# EAGLE design AMR3350_old (EAGLE 9.2.0)
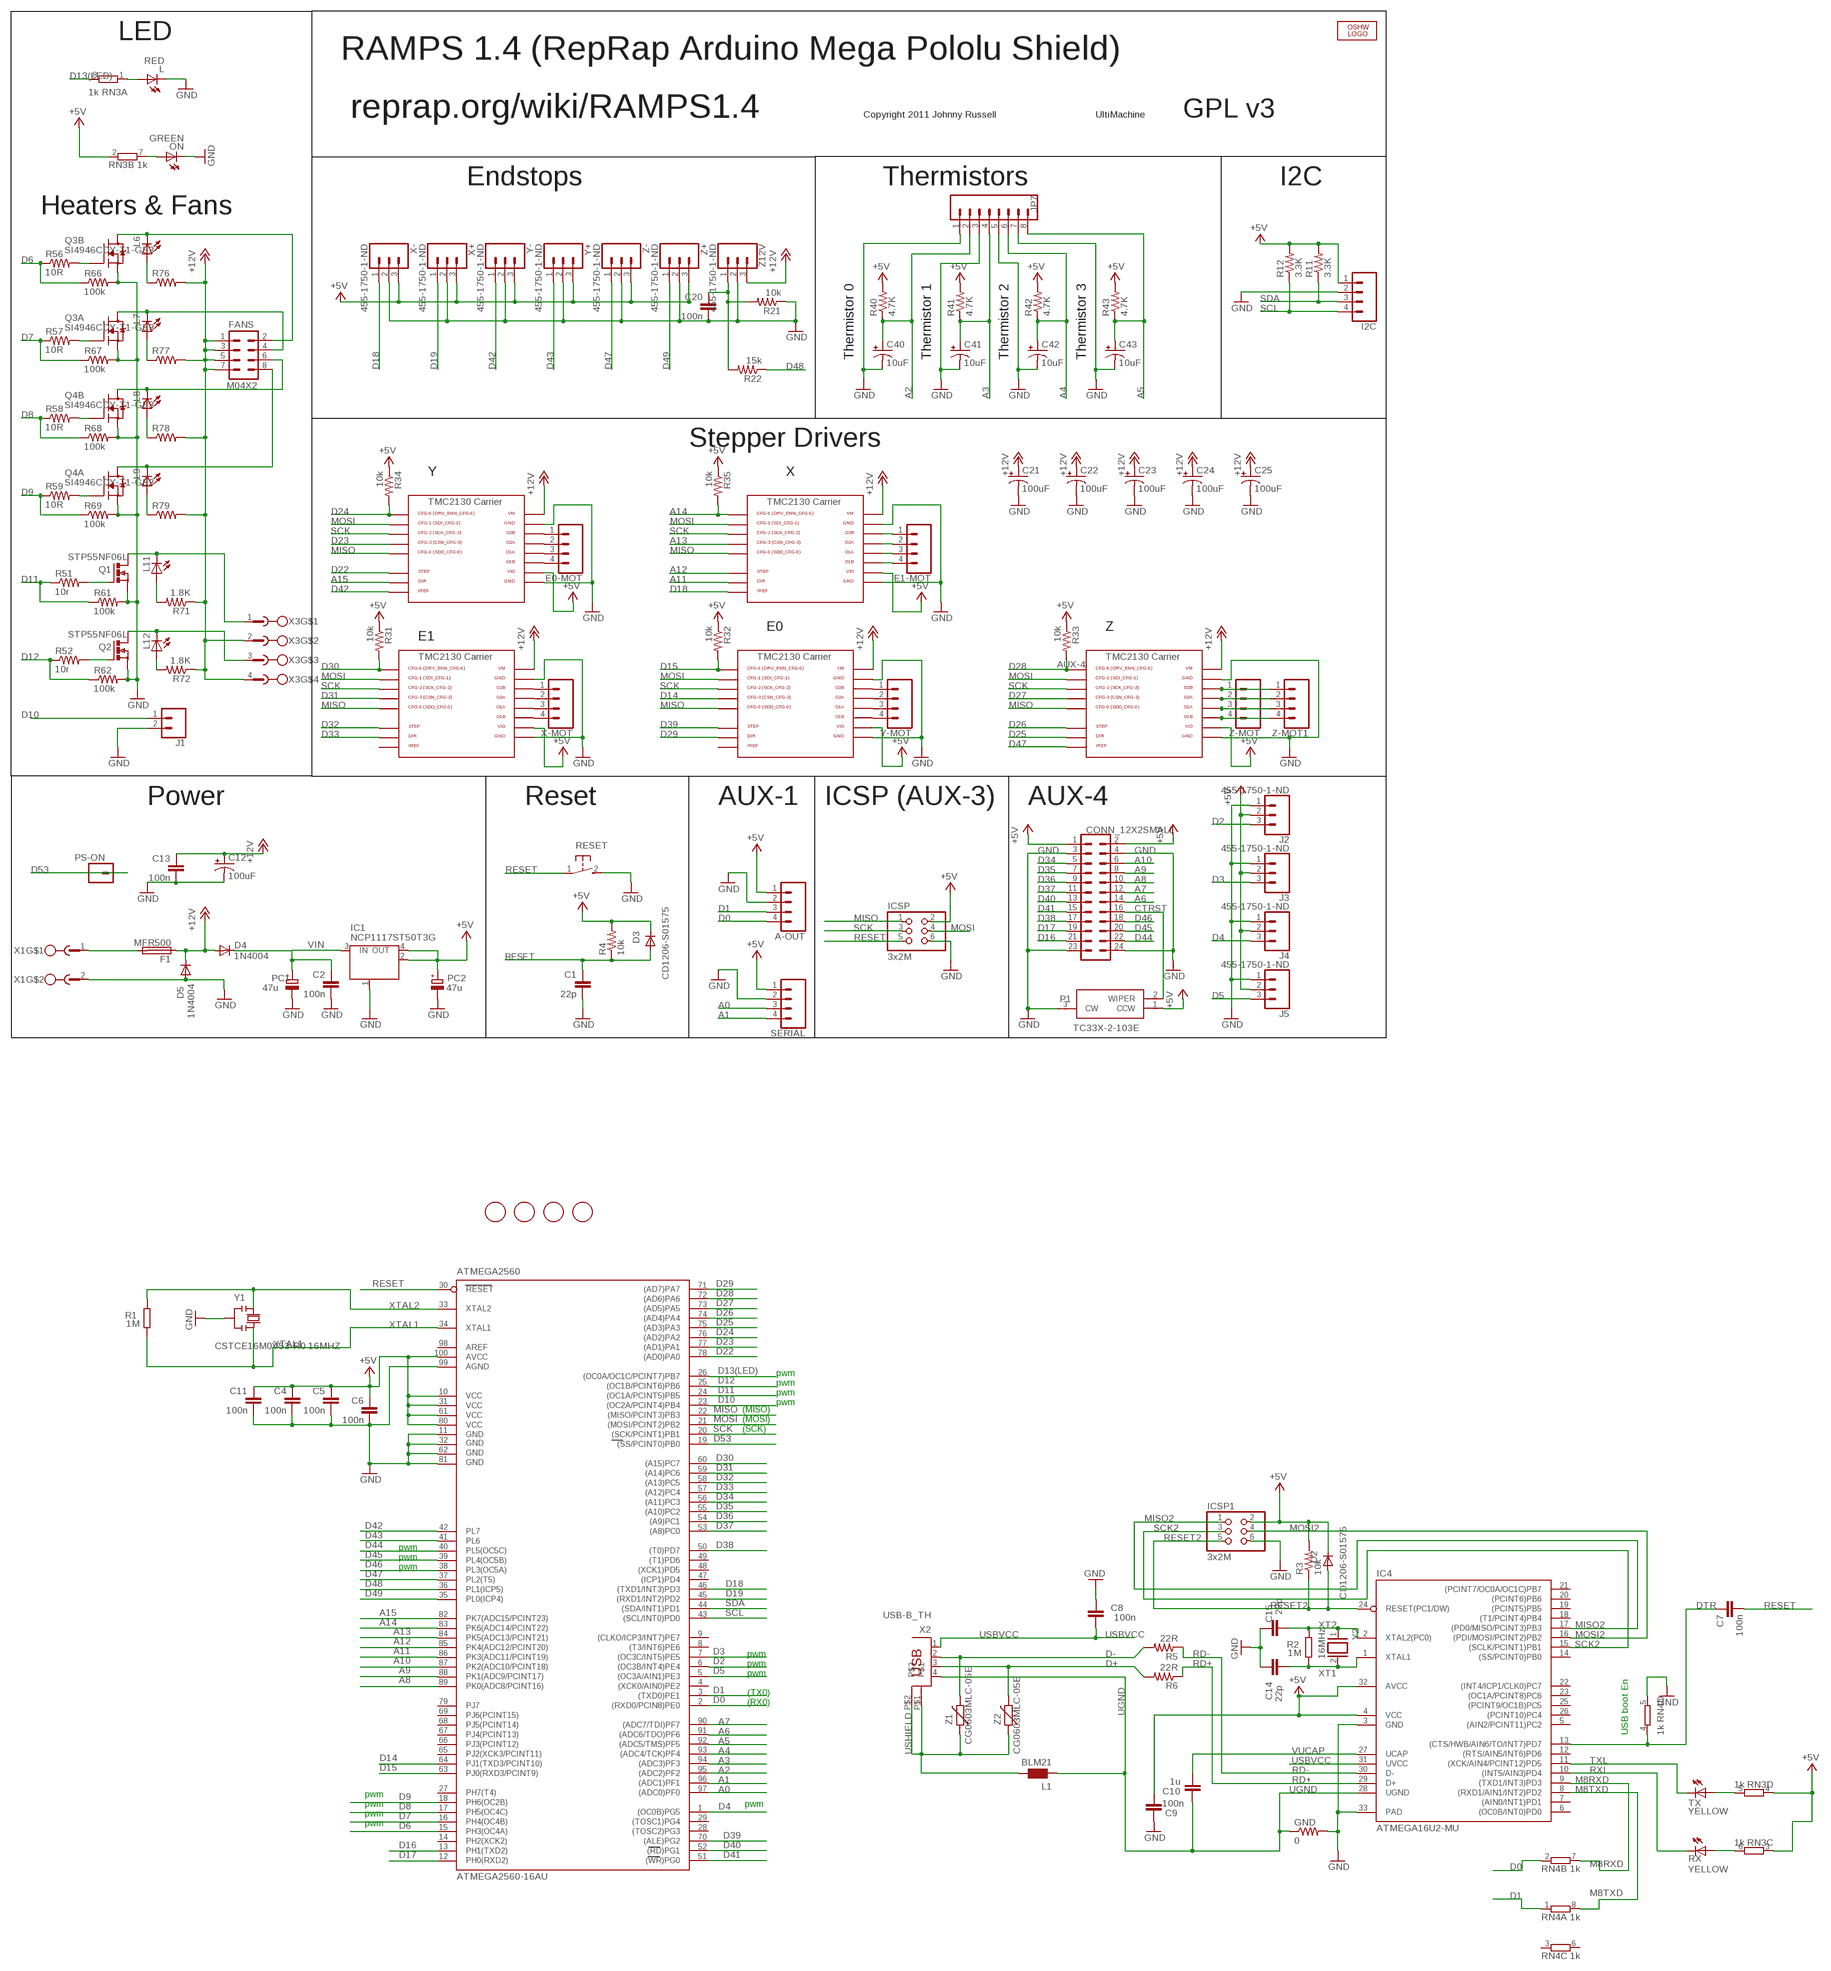
[diagram p0: schematic, sheet 1]

## Parts
A-OUT  CONN_04SMALL  [1X04_SMALL]
ATMEGA2560  ATMEGA2560-16AU  ATMEGA25602560-16AU  [TQFP100]
AUX-4  CONN_12X2SMALL  [2X12_SMALL]
C1  22p  C-EU  [C0805RND]
C2  100n  C-EU  [C0805RND]
C4  100n  C-EU  [C0805RND]
C5  100n  C-EU  [C0805RND]
C6  100n  C-EU  [C0805RND]
C7  100n  C-EU  [C0805RND]
C8  100n  C-EU0603-RND  [C0603-ROUND]
C9  100n  C-EU0603-RND  [C0603-ROUND]
C10  1u  C-EU0603-RND  [C0603-ROUND]
C11  100n  C-EU0603-RND  [C0603-ROUND]
C12  100uF  CPOL-US153CLV-0605  [153CLV-0605]
C13  100n  C-EU  [C0805RND]
C14  22p  C-EU0603-RND  [C0603-ROUND]
C15  22p  C-EU0603-RND  [C0603-ROUND]
C20  100n  C-EU  [C0805RND]
C21  100uF  CPOL-US153CLV-0605  [153CLV-0605]
C22  100uF  CPOL-US153CLV-0605  [153CLV-0605]
C23  100uF  CPOL-US153CLV-0605  [153CLV-0605]
C24  100uF  CPOL-US153CLV-0605  [153CLV-0605]
C25  100uF  CPOL-US153CLV-0605  [153CLV-0605]
C40  10uF  CPOL-US153CLV-0405  [153CLV-0405]
C41  10uF  CPOL-US153CLV-0405  [153CLV-0405]
C42  10uF  CPOL-US153CLV-0405  [153CLV-0405]
C43  10uF  CPOL-US153CLV-0405  [153CLV-0405]
D2  CD1206-S01575  DIODE-MINIMELF  [MINIMELF]
D3  CD1206-S01575  DIODE-MINIMELF  [MINIMELF]
D4  1N4004  [DO41-10]
D5  1N4004  [DO41-10]
E0-MOT  CONN_04SMALL  [1X04_SMALL]
E1-MOT  CONN_04SMALL  [1X04_SMALL]
F1  MFR500  PTCFUSE  [MFR500]
FANS  M04X2  [2X4]
FD1  FIDUCIALMOUNT  [FIDUCIA-MOUNT]
FD2  FIDUCIALMOUNT  [FIDUCIA-MOUNT]
FD3  FIDUCIALMOUNT  [FIDUCIA-MOUNT]
FD4  FIDUCIALMOUNT  [FIDUCIA-MOUNT]
GND  0  R-US_R0201  [R0201]
I2C  CONN_04SMALL  [1X04_SMALL]
IC1  NCP1117ST50T3G  MC33269ST-3.3T3  [SOT223]
IC4  ATMEGA16U2-MU  [MLF32]
ICSP  3x2M  PINHD-2X3  [2X03]
ICSP1  3x2M  PINHD-2X3  [2X03]
J1  CONN_02  [1X02]
J2  455-1750-1-ND  CONN_03SMALL  [1X03_SMALL]
J3  455-1750-1-ND  CONN_03SMALL  [1X03_SMALL]
J4  455-1750-1-ND  CONN_03SMALL  [1X03_SMALL]
J5  455-1750-1-ND  CONN_03SMALL  [1X03_SMALL]
JP7  CONN_08  [1X08_SMALL]
L  RED  LEDCHIP-LED0805  [CHIP-LED0805]
L1  BLM21  WE-CBF_0805  [0805]
L6  LEDCHIP-LED0603  [CHIP-LED0603]
L7  LEDCHIP-LED0603  [CHIP-LED0603]
L8  LEDCHIP-LED0603  [CHIP-LED0603]
L9  LEDCHIP-LED0603  [CHIP-LED0603]
L11  LEDCHIP-LED0805  [CHIP-LED0805]
L12  LEDCHIP-LED0805  [CHIP-LED0805]
LOGO2  OSHW_LOGO_6MILX0100-NT  [OSHW_6X100_NOTEXT]
ON  GREEN  LEDCHIP-LED0805  [CHIP-LED0805]
P1  TC33X-2-103E  [TC33X-2_1]
PC1  47u  CPOL-EUD  [PANASONIC_D]
PC2  47u  CPOL-EUD  [PANASONIC_D]
PS-ON  CONN_01SMALL  [1X01_SMALL]
Q1  STP55NF06L  IRF512  [TO220BV]
Q2  STP55NF06L  IRF512  [TO220BV]
Q3  SI4946CDY-T1-GE3  [SOIC127P600X175-8N]
Q4  SI4946CDY-T1-GE3  [SOIC127P600X175-8N]
R1  1M  R-EU_  [R0805RND]
R2  1M  R-EU_R0603  [R0603-ROUND]
R3  10k  R-US_R0805  [R0805]
R4  10k  R-US_R0805  [R0805]
R5  22R  R-US_R0603  [R0603]
R6  22R  R-US_R0603  [R0603]
R11  3.3K  R-US_R0805  [R0805]
R12  3.3K  R-US_R0805  [R0805]
R21  10k  R-US_R0805  [R0805]
R22  15k  R-US_R0805  [R0805]
R31  10k  R-US_R0805  [R0805]
R32  10k  R-US_R0805  [R0805]
R33  10k  R-US_R0805  [R0805]
R34  10k  R-US_R0805  [R0805]
R35  10k  R-US_R0805  [R0805]
R40  4.7K  R-US_R0805  [R0805]
R41  4.7K  R-US_R0805  [R0805]
R42  4.7K  R-US_R0805  [R0805]
R43  4.7K  R-US_R0805  [R0805]
R51  10r  R-US_R0805  [R0805]
R52  10r  R-US_M0805  [M0805]
R56  10R  R-US_R0805  [R0805]
R57  10R  R-US_R0805  [R0805]
R58  10R  R-US_R0805  [R0805]
R59  10R  R-US_R0805  [R0805]
R61  100k  R-US_R0805  [R0805]
R62  100k  R-US_R0805  [R0805]
R66  100k  R-US_R0805  [R0805]
R67  100k  R-US_R0805  [R0805]
R68  100k  R-US_R0805  [R0805]
R69  100k  R-US_R0805  [R0805]
R71  1.8K  R-US_R0805  [R0805]
R72  1.8K  R-US_R0805  [R0805]
R76  R-US_R0603  [R0603]
R77  R-US_R0603  [R0603]
R78  R-US_R0603  [R0603]
R79  R-US_R0603  [R0603]
RESET  31-XX  [B3F-31XX]
RN3  1k  4R-NCAY16  [CAY16]
RN4  1k  4R-NCAY16  [CAY16]
RX  YELLOW  LEDCHIP-LED0805  [CHIP-LED0805]
SERIAL  CONN_04SMALL  [1X04_SMALL]
TX  YELLOW  LEDCHIP-LED0805  [CHIP-LED0805]
U$1  TMC2130BREAKOUT  [TMC2130BREAKOUT]
U$2  TMC2130BREAKOUT  [TMC2130BREAKOUT]
U$3  TMC2130BREAKOUT  [TMC2130BREAKOUT]
U$4  TMC2130BREAKOUT  [TMC2130BREAKOUT]
U$5  TMC2130BREAKOUT  [TMC2130BREAKOUT]
X1  2-PIN  [2-PIN]
X2  USB-B_TH  PN61729NOSILK  [PN61729-NOSILK]
X3  4-PIN  [4-PIN]
X+  455-1750-1-ND  CONN_03SMALL  [1X03_SMALL]
X-  455-1750-1-ND  CONN_03SMALL  [1X03_SMALL]
X-MOT  CONN_04SMALL  [1X04_SMALL]
Y1  CSTCE16M0V53-R0 16MHZ  RESONATORMU  [RESONATOR]
Y2  16MHz  XTAL/S  [QS]
Y+  455-1750-1-ND  CONN_03SMALL  [1X03_SMALL]
Y-  455-1750-1-ND  CONN_03SMALL  [1X03_SMALL]
Y-MOT  CONN_04SMALL  [1X04_SMALL]
Z1  CG0603MLC-05E  VARISTORCN0603  [CT/CN0603]
Z2  CG0603MLC-05E  VARISTORCN0603  [CT/CN0603]
Z12V  455-1750-1-ND  CONN_03SMALL  [1X03_SMALL]
Z+  455-1750-1-ND  CONN_03SMALL  [1X03_SMALL]
Z-  455-1750-1-ND  CONN_03SMALL  [1X03_SMALL]
Z-MOT  CONN_04SMALL  [1X04_SMALL]
Z-MOT1  CONN_04SMALL  [1X04_SMALL]

## Nets
12V-IN [power]: F1.2 X1.1
+5V [power usb]: A-OUT.1 ATMEGA2560.10(VCC) ATMEGA2560.31(VCC1) ATMEGA2560.61(VCC2) ATMEGA2560.80(VCC3) ATMEGA2560.100(AVCC) AUX-4.1 AUX-4.2 C4.1 C5.1 C6.1 C9.1 C11.1 D2.C D3.C I2C.1 IC1.2(OUT) IC1.4(OUT) IC4.4(VCC) IC4.32(AVCC) ICSP1.2 ICSP.2 J2.2 J3.2 J4.2 J5.2 P1.1(CCW) PC2.+ R3.2 R4.2 R11.2 R12.2 R31.1 R32.1 R33.1 R34.1 R35.1 R40.2 R41.2 R42.2 R43.2 RN3.2 RN3.3 RN3.4 SERIAL.1 U$1.VIO U$2.VIO U$3.VIO U$4.VIO U$5.VIO X+.3 X-.3 Y+.3 Y-.3 Z+.3 Z-.3
+12V: C12.+ C13.1 C21.+ C22.+ C23.+ C24.+ C25.+ D4.A D5.C F1.1 FANS.1 FANS.3 FANS.5 FANS.7 R71.1 R72.1 R76.2 R77.2 R78.2 R79.2 U$1.VM U$2.VM U$3.VM U$4.VM U$5.VM X3.2 X3.4 Z12V.3
A0: ATMEGA2560.97((ADC0)PF0) SERIAL.3
A1: ATMEGA2560.96((ADC1)PF1) SERIAL.4
A2: ATMEGA2560.95((ADC2)PF2) C40.+ JP7.2 R40.1
A3: ATMEGA2560.94((ADC3)PF3) C41.+ JP7.4 R41.1
A4: ATMEGA2560.93((ADC4/TCK)PF4) C42.+ JP7.6 R42.1
A5: ATMEGA2560.92((ADC5/TMS)PF5) C43.+ JP7.8 R43.1
A6: ATMEGA2560.91((ADC6/TDO)PF6) AUX-4.14
A7: ATMEGA2560.90((ADC7/TDI)PF7) AUX-4.12
A8: ATMEGA2560.89(PK0(ADC8/PCINT16)) AUX-4.10
A9: ATMEGA2560.88(PK1(ADC9/PCINT17)) AUX-4.8
A10: ATMEGA2560.87(PK2(ADC10/PCINT18)) AUX-4.6
A11: ATMEGA2560.86(PK3(ADC11/PCINT19)) U$4.DIR
A12: ATMEGA2560.85(PK4(ADC12/PCINT20)) U$4.STEP
A13: ATMEGA2560.84(PK5(ADC13/PCINT21)) U$4.CFG-3
A14: ATMEGA2560.83(PK6(ADC14/PCINT22)) R35.2 U$4.CFG-6
A15: ATMEGA2560.82(PK7(ADC15/PCINT23)) U$5.DIR
CTRST: AUX-4.16 P1.2(WIPER)
D0: A-OUT.4 ATMEGA2560.2((RXD0/PCIN8)PE0) RN4.2
D1: A-OUT.3 ATMEGA2560.3((TXD0)PE1) RN4.1
D2: ATMEGA2560.6((OC3B/INT4)PE4) J2.3
D3: ATMEGA2560.7((OC3C/INT5)PE5) J3.3
D4: ATMEGA2560.1((OC0B)PG5) J4.3
D5: ATMEGA2560.5((OC3A/AIN1)PE3) J5.3
D6: ATMEGA2560.15(PH3(OC4A)) R56.1 R66.1
D7: ATMEGA2560.16(PH4(OC4B)) R57.1 R67.1
D8: ATMEGA2560.17(PH5(OC4C)) R58.1 R68.1
D9: ATMEGA2560.18(PH6(OC2B)) R59.1 R69.1
D10: ATMEGA2560.23((OC2A/PCINT4)PB4) J1.1
D11: ATMEGA2560.24((OC1A/PCINT5)PB5) R51.1 R61.1
D12: ATMEGA2560.25((OC1B/PCINT6)PB6) R52.1 R62.1
D13(LED): ATMEGA2560.26((OC0A/OC1C/PCINT7)PB7) RN3.8
D14: ATMEGA2560.64(PJ1(TXD3/PCINT10)) U$2.CFG-3
D15: ATMEGA2560.63(PJ0(RXD3/PCINT9)) R32.2 U$2.CFG-6
D16: ATMEGA2560.13(PH1(TXD2)) AUX-4.21
D17: ATMEGA2560.12(PH0(RXD2)) AUX-4.19
D18: ATMEGA2560.46((TXD1/INT3)PD3) U$4.IREF X-.1
D19: ATMEGA2560.45((RXD1/INT2)PD2) X+.1
D22: ATMEGA2560.78((AD0)PA0) U$5.STEP
D23: ATMEGA2560.77((AD1)PA1) U$5.CFG-3
D24: ATMEGA2560.76((AD2)PA2) R34.2 U$5.CFG-6
D25: ATMEGA2560.75((AD3)PA3) U$3.DIR
D26: ATMEGA2560.74((AD4)PA4) U$3.STEP
D27: ATMEGA2560.73((AD5)PA5) U$3.CFG-3
D28: ATMEGA2560.72((AD6)PA6) R33.2 U$3.CFG-6
D29: ATMEGA2560.71((AD7)PA7) U$2.DIR
D30: ATMEGA2560.60((A15)PC7) R31.2 U$1.CFG-6
D31: ATMEGA2560.59((A14)PC6) U$1.CFG-3
D32: ATMEGA2560.58((A13)PC5) U$1.STEP
D33: ATMEGA2560.57((A12)PC4) U$1.DIR
D34: ATMEGA2560.56((A11)PC3) AUX-4.5
D35: ATMEGA2560.55((A10)PC2) AUX-4.7
D36: ATMEGA2560.54((A9)PC1) AUX-4.9
D37: ATMEGA2560.53((A8)PC0) AUX-4.11
D38: ATMEGA2560.50((T0)PD7) AUX-4.17
D39: ATMEGA2560.70((ALE)PG2) U$2.STEP
D40: ATMEGA2560.52((RD)PG1) AUX-4.13
D41: ATMEGA2560.51((WR)PG0) AUX-4.15
D42: ATMEGA2560.42(PL7) U$5.IREF Y-.1
D43: ATMEGA2560.41(PL6) Y+.1
D44: ATMEGA2560.40(PL5(OC5C)) AUX-4.22
D45: ATMEGA2560.39(PL4(OC5B)) AUX-4.20
D46: ATMEGA2560.38(PL3(OC5A)) AUX-4.18
D47: ATMEGA2560.37(PL2(T5)) U$3.IREF Z-.1
D48: ATMEGA2560.36(PL1(ICP5)) R22.1
D49: ATMEGA2560.35(PL0(ICP4)) Z+.1
D53: ATMEGA2560.19((SS/PCINT0)PB0) PS-ON.1
D+: R6.2 X2.3 Z2.2
D-: R5.2 X2.2 Z1.2
DTR: C7.1 IC4.13((CTS/HWB/AIN6/TO/INT7)PD7) RN4.4
E0-1: E0-MOT.1 U$5.OB2(O2B)
E0-2: E0-MOT.2 U$5.OB1(O2A)
E0-3: E0-MOT.3 U$5.OA1(O1A)
E0-4: E0-MOT.4 U$5.OA2(O1B)
E1-1: E1-MOT.1 U$4.OB2(O2B)
E1-2: E1-MOT.2 U$4.OB1(O2A)
E1-3: E1-MOT.3 U$4.OA1(O1A)
E1-4: E1-MOT.4 U$4.OA2(O1B)
GND [gnd]: A-OUT.2 ATMEGA2560.11(GND) ATMEGA2560.32(GND1) ATMEGA2560.62(GND2) ATMEGA2560.81(GND3) ATMEGA2560.99(AGND) AUX-4.3 AUX-4.4 AUX-4.23 AUX-4.24 C1.2 C2.2 C4.2 C5.2 C6.2 C8.2 C9.2 C11.2 C12.- C13.2 C14.2 C15.2 C20.2 C21.- C22.- C23.- C24.- C25.- C40.- C41.- C42.- C43.- D5.A GND.2 I2C.2 IC1.1(GND/ADJ) IC4.3(GND) IC4.33(PAD) ICSP1.6 ICSP.6 J1.2 J2.1 J3.1 J4.1 J5.1 JP7.1 JP7.3 JP7.5 JP7.7 L.C ON.C P1.3(CW) PC1.- PC2.- Q1.S Q2.S Q3.1(A:S) Q3.3(B:S) Q4.1(A:S) Q4.3(B:S) R21.1 R61.2 R62.2 R66.2 R67.2 R68.2 R69.2 RESET.2(S) RN4.5 SERIAL.2 U$1.GND U$1.GND@0(GND) U$2.GND U$2.GND@0(GND) U$3.GND U$3.GND@0(GND) U$4.GND U$4.GND@0(GND) U$5.GND U$5.GND@0(GND) X1.2 X+.2 X-.2 Y1.2 Y+.2 Y-.2 Z12V.2 Z+.2 Z-.2
L: L.A RN3.1
M8RXD: IC4.9((TXD1/INT3)PD3) RN4.7
M8TXD: IC4.8((RXD1/AIN1/INT2)PD2) RN4.8
MISO: ATMEGA2560.22((MISO/PCINT3)PB3) ICSP.1 U$1.CFG-0 U$2.CFG-0 U$3.CFG-0 U$4.CFG-0 U$5.CFG-0
MISO2: IC4.17((PD0/MISO/PCINT3)PB3) ICSP1.1
MOSI: ATMEGA2560.21((MOSI/PCINT2)PB2) ICSP.4 U$1.CFG-1 U$2.CFG-1 U$3.CFG-1 U$4.CFG-1 U$5.CFG-1
MOSI2: IC4.16((PDI/MOSI/PCINT2)PB2) ICSP1.4
N$1: L9.A R79.1
N$2: L8.A R78.1
N$3: C20.1 R21.2 R22.2 Z12V.1
N$4: L6.A R76.1
N$5: L7.A R77.1
N$107: L12.A R72.2
N$108: L11.A R71.2
ON: ON.A RN3.7
Q1-D: L11.C Q1.D X3.1
Q1-G: Q1.G R51.2
Q2-D: L12.C Q2.D X3.3
Q2-G: Q2.G R52.2
Q6-D: FANS.2 L6.C Q3.5(B:D) Q3.6(B:D)
Q6-G: Q3.4(B:G) R56.2
Q7-D: FANS.4 L7.C Q3.7(A:D) Q3.8(A:D)
Q7-G: Q3.2(A:G) R57.2
Q8-D: FANS.6 L8.C Q4.5(B:D) Q4.6(B:D)
Q8-G: Q4.4(B:G) R58.2
Q9-D: FANS.8 L9.C Q4.7(A:D) Q4.8(A:D)
Q9-G: Q4.2(A:G) R59.2
RD+: IC4.29(D+) R6.1
RD-: IC4.30(D-) R5.1
RESET: ATMEGA2560.30(RESET) C1.1 C7.2 D3.A ICSP.5 R4.1 RESET.1(P)
RESET2: D2.A IC4.24(RESET(PC1/DW)) ICSP1.5 R3.1
RX: RN3.6 RX.A
RXL: IC4.10((INT5/AIN3)PD4) RX.C
SCK: ATMEGA2560.20((SCK/PCINT1)PB1) ICSP.3 U$1.CFG-2 U$2.CFG-2 U$3.CFG-2 U$4.CFG-2 U$5.CFG-2
SCK2: IC4.15((SCLK/PCINT1)PB1) ICSP1.3
SCL: ATMEGA2560.43((SCL/INT0)PD0) I2C.4 R12.1
SDA: ATMEGA2560.44((SDA/INT1)PD1) I2C.3 R11.1
TX: RN3.5 TX.A
TXL: IC4.11((XCK/AIN4/PCINT12)PD5) TX.C
UGND [gnd]: C10.2 GND.1 IC4.28(UGND) L1.1 X2.4
USBVCC [power usb]: C8.1 IC4.31(UVCC) X2.1
USHIELD [gnd]: L1.2 X2.P$1 X2.P$2 Z1.1 Z2.1
VIN [power]: C2.1 D4.C IC1.3(IN) PC1.+
VUCAP: C10.1 IC4.27(UCAP)
X-1: U$1.OB2(O2B) X-MOT.1
X-2: U$1.OB1(O2A) X-MOT.2
X-3: U$1.OA1(O1A) X-MOT.3
X-4: U$1.OA2(O1B) X-MOT.4
XT1: C14.1 IC4.1(XTAL1) R2.1 Y2.2
XT2: C15.1 IC4.2(XTAL2(PC0)) R2.2 Y2.1
XTAL1: ATMEGA2560.34(XTAL1) R1.1 Y1.3
XTAL2: ATMEGA2560.33(XTAL2) R1.2 Y1.1
Y-1: U$2.OB2(O2B) Y-MOT.1
Y-2: U$2.OB1(O2A) Y-MOT.2
Y-3: U$2.OA1(O1A) Y-MOT.3
Y-4: U$2.OA2(O1B) Y-MOT.4
Z-1: U$3.OB2(O2B) Z-MOT1.1 Z-MOT.1
Z-2: U$3.OB1(O2A) Z-MOT1.2 Z-MOT.2
Z-3: U$3.OA1(O1A) Z-MOT1.3 Z-MOT.3
Z-4: U$3.OA2(O1B) Z-MOT1.4 Z-MOT.4
Unconnected: ATMEGA2560.4((XCK0/AIN0)PE2) ATMEGA2560.8((T3/INT6)PE6) ATMEGA2560.9((CLKO/ICP3/INT7)PE7) ATMEGA2560.14(PH2(XCK2)) ATMEGA2560.27(PH7(T4)) ATMEGA2560.28((TOSC2)PG3) ATMEGA2560.29((TOSC1)PG4) ATMEGA2560.47((ICP1)PD4) ATMEGA2560.48((XCK1)PD5) ATMEGA2560.49((T1)PD6) ATMEGA2560.65(PJ2(XCK3/PCINT11)) ATMEGA2560.66(PJ3(PCINT12)) ATMEGA2560.67(PJ4(PCINT13)) ATMEGA2560.68(PJ5(PCINT14)) ATMEGA2560.69(PJ6(PCINT15)) ATMEGA2560.79(PJ7) ATMEGA2560.98(AREF) IC4.5((AIN2/PCINT11)PC2) IC4.6((OC0B/INT0)PD0) IC4.7((AIN0/INT1)PD1) IC4.12((RTS/AIN5/INT6)PD6) IC4.14((SS/PCINT0)PB0) IC4.18((T1/PCINT4)PB4) IC4.19((PCINT5)PB5) IC4.20((PCINT6)PB6) IC4.21((PCINT7/OC0A/OC1C)PB7) IC4.22((INT4/ICP1/CLK0)PC7) IC4.23((OC1A/PCINT8)PC6) IC4.25((PCINT9/OC1B)PC5) IC4.26((PCINT10)PC4) RN4.3 RN4.6 U$1.IREF U$2.IREF

## Notes on the sheet
- LED
- RAMPS 1.4 (RepRap Arduino Mega Pololu Shield)
- reprap.org/wiki/RAMPS1.4 | Copyright 2011 Johnny Russell | UltiMachine | GPL v3
- Endstops | Thermistors | I2C
- Heaters & Fans
- Thermistor 0 | Thermistor 1 | Thermistor 2 | Thermistor 3
- Stepper Drivers
- Y | X
- E0 | Z
- E1
- Power | Reset | AUX-1 | ICSP (AUX-3) | AUX-4
- pwm
- pwm
- pwm
- pwm
- (MISO)
- (MOSI)
- (SCK)
- pwm
- pwm
- pwm
- pwm
- pwm
- pwm
- (TX0)
- (RX0)
- USB boot En
- pwm
- pwm | pwm
- pwm
- pwm

## Library data of the parts
A-OUT E0-MOT E1-MOT I2C SERIAL X-MOT Y-MOT Z-MOT Z-MOT1 = SparkFun-Connectors:CONN_04: Multi connection point. Often used as Generic Header-pin footprint for 0.1 inch spaced/style header connections On any of the 0.1 inch spaced packages, you can populate with these: Break Away Headers - Straight <https://www.sparkfun.com/products/116> (PRT-00116) Break Away Male Headers - Right Angle <https://www.sparkfun.com/products/553> (PRT-00553) Female Headers <https://www.sparkfun.com/products/115> (PRT-00115) Break Away Headers - Machine Pin <https://www.sparkfun.com/products/117> (PRT-00117) Break Away Female Headers - Swiss Machine Pin <https://www.sparkfun.com/products/743> (PRT-00743) For SCREWTERMINALS and SPRING TERMINALS visit here: Screw Terimnals on SparkFun.com <https://www.sparkfun.com/search/results?term=Screw+Terminals> (5mm/3.5mm/2.54mm spacing) This device is also useful as a general connection point to wire up your design to another part of your project. Our various solder wires solder well into these plated through hole pads. Hook-Up Wire - Assortment (Stranded, 22 AWG) <https://www.sparkfun.com/products/11375> (PRT-11375) Hook-Up Wire - Assortment (Solid Core, 22 AWG) <https://www.sparkfun.com/products/11367> (PRT-11367) View the entire wire category on our website here <https://www.sparkfun.com/categories/141> Special notes: Molex polarized connector foot print use with SKU : PRT-08231 with associated crimp pins and housings. 1MM SMD Version SKU: PRT-10208
ATMEGA2560 = SmartPrj:ATMEGA2560: MICROCONTROLLER 64/128/256 Kbytes FLASH 4 Kbytes EEPROM 8 Kbytes SRAM 86 General Purpose I/O pins 12-channels16-bit PWM 4 x Serial USARTs 16-channels 10-bit A/D
AUX-4 = SparkFun-Connectors:CONN_12X2: Multi connection point. Often used as Generic Header-pin footprint for 0.1 inch spaced/style header connections On any of the 0.1 inch spaced packages, you can populate with these: Break Away Headers - Straight <https://www.sparkfun.com/products/116> (PRT-00116) Break Away Male Headers - Right Angle <https://www.sparkfun.com/products/553> (PRT-00553) Female Headers <https://www.sparkfun.com/products/115> (PRT-00115) Break Away Headers - Machine Pin <https://www.sparkfun.com/products/117> (PRT-00117) Break Away Female Headers - Swiss Machine Pin <https://www.sparkfun.com/products/743> (PRT-00743)
C1 C2 C4-C11 C13-C15 C20 = SmartPrj:C-EU: CAPACITOR, European symbol
C12 C21-C25 C40-C43 = adafruit:CPOL-US: POLARIZED CAPACITOR, American symbol
D2 D3 = diode:DIODE-: DIODE
D4 D5 = diode:1N4004: DIODE general purpose rectifier, 1 A
F1 = RepRapjr:PTCFUSE: LITTLEFUSE Picofuse/slow Littlefuse
FANS = SparkFun:M04X2
FD1-FD4 = SmartPrj:FIDUCIALMOUNT
GND R3-R6 R51 R52 R56-R59 R66-R69 R76-R79 = resistor:R-US_: RESISTOR, American symbol
IC1 = linear:MC33269ST*: Adjustable Output Low Dropout Voltage Regulator 800 mA Source: http://www.onsemi.com/pub/Collateral/MC33269-D.PDF
IC4 = SmartPrj:ATMEGA16U2-
ICSP ICSP1 = SmartPrj:PINHD-2X3: PIN HEADER
J1 = SparkFun-Connectors:CONN_02: Multi connection point. Often used as Generic Header-pin footprint for 0.1 inch spaced/style header connections On any of the 0.1 inch spaced packages, you can populate with these: Break Away Headers - Straight <https://www.sparkfun.com/products/116> (PRT-00116) Break Away Male Headers - Right Angle <https://www.sparkfun.com/products/553> (PRT-00553) Female Headers <https://www.sparkfun.com/products/115> (PRT-00115) Break Away Headers - Machine Pin <https://www.sparkfun.com/products/117> (PRT-00117) Break Away Female Headers - Swiss Machine Pin <https://www.sparkfun.com/products/743> (PRT-00743) For SCREWTERMINALS and SPRING TERMINALS visit here: Screw Terimnals on SparkFun.com <https://www.sparkfun.com/search/results?term=Screw+Terminals> (5mm/3.5mm/2.54mm spacing) This device is also useful as a general connection point to wire up your design to another part of your project. Our various solder wires solder well into these plated through hole pads. Hook-Up Wire - Assortment (Stranded, 22 AWG) <https://www.sparkfun.com/products/11375> (PRT-11375) Hook-Up Wire - Assortment (Solid Core, 22 AWG) <https://www.sparkfun.com/products/11367> (PRT-11367) View the entire wire category on our website here <https://www.sparkfun.com/categories/141> Special notes: Molex polarized connector foot print use with: PRT-08233 with associated crimp pins and housings. 2.54_SCREWTERM for use with PRT-10571. 3.5mm Screw Terminal footprints for PRT-08084 5mm Screw Terminal footprints for use with PRT-08432
J2-J5 X+ X- Y+ Y- Z12V Z+ Z- = SparkFun-Connectors:CONN_03: Multi connection point. Often used as Generic Header-pin footprint for 0.1 inch spaced/style header connections On any of the 0.1 inch spaced packages, you can populate with these: Break Away Headers - Straight <https://www.sparkfun.com/products/116> (PRT-00116) Break Away Male Headers - Right Angle <https://www.sparkfun.com/products/553> (PRT-00553) Female Headers <https://www.sparkfun.com/products/115> (PRT-00115) Break Away Headers - Machine Pin <https://www.sparkfun.com/products/117> (PRT-00117) Break Away Female Headers - Swiss Machine Pin <https://www.sparkfun.com/products/743> (PRT-00743) Stackable Header - 3 Pin (Female, 0.1") <https://www.sparkfun.com/products/13875> (PRT-13875) For SCREWTERMINALS and SPRING TERMINALS visit here: Screw Terimnals on SparkFun.com <https://www.sparkfun.com/search/results?term=Screw+Terminals> (5mm/3.5mm/2.54mm spacing) This device is also useful as a general connection point to wire up your design to another part of your project. Our various solder wires solder well into these plated through hole pads. Hook-Up Wire - Assortment (Stranded, 22 AWG) <https://www.sparkfun.com/products/11375> (PRT-11375) Hook-Up Wire - Assortment (Solid Core, 22 AWG) <https://www.sparkfun.com/products/11367> (PRT-11367) View the entire wire category on our website here <https://www.sparkfun.com/categories/141> Special notes: Molex polarized connector foot print use with SKU : PRT-08232 with associated crimp pins and housings.
JP7 = SparkFun-Connectors:CONN_08: Multi connection point. Often used as Generic Header-pin footprint for 0.1 inch spaced/style header connections On any of the 0.1 inch spaced packages, you can populate with these: Break Away Headers - Straight <https://www.sparkfun.com/products/116> (PRT-00116) Break Away Male Headers - Right Angle <https://www.sparkfun.com/products/553> (PRT-00553) Female Headers <https://www.sparkfun.com/products/115> (PRT-00115) Break Away Headers - Machine Pin <https://www.sparkfun.com/products/117> (PRT-00117) Break Away Female Headers - Swiss Machine Pin <https://www.sparkfun.com/products/743> (PRT-00743) Arduino Stackable Header - 8 Pin <https://www.sparkfun.com/products/9279> (PRT-09279) For SCREWTERMINALS and SPRING TERMINALS visit here: Screw Terimnals on SparkFun.com <https://www.sparkfun.com/search/results?term=Screw+Terminals> (5mm/3.5mm/2.54mm spacing) This device is also useful as a general connection point to wire up your design to another part of your project. Our various solder wires solder well into these plated through hole pads. Hook-Up Wire - Assortment (Stranded, 22 AWG) <https://www.sparkfun.com/products/11375> (PRT-11375) Hook-Up Wire - Assortment (Solid Core, 22 AWG) <https://www.sparkfun.com/products/11367> (PRT-11367) View the entire wire category on our website here <https://www.sparkfun.com/categories/141> Special notes: Molex polarized connector foot print use with SKU : PRT-08231 with associated crimp pins and housings. 1MM SMD Version SKU: PRT-10208 NOTES ON THE VARIANTS LOCK and LOCK_LONGPADS... This footprint was designed to help hold the alignment of a through-hole component (i.e. 6-pin header) while soldering it into place. You may notice that each hole has been shifted either up or down by 0.005 of an inch from it's more standard position (which is a perfectly straight line). This slight alteration caused the pins (the squares in the middle) to touch the edges of the holes. Because they are alternating, it causes a "brace" to hold the component in place. 0.005 has proven to be the perfect amount of "off-center" position when using our standard breakaway headers. Although looks a little odd when you look at the bare footprint, once you have a header in there, the alteration is very hard to notice. Also,if you push a header all the way into place, it is covered up entirely on the bottom side.
L L6-L9 L11 L12 ON RX TX = led:LED: LED OSRAM: - CHIPLED LG R971, LG N971, LY N971, LG Q971, LY Q971, LO R971, LY R971 LH N974, LH R974 LS Q976, LO Q976, LY Q976 LO Q996 - Hyper CHIPLED LW Q18S LB Q993, LB Q99A, LB R99A - SideLED LS A670, LO A670, LY A670, LG A670, LP A670 LB A673, LV A673, LT A673, LW A673 LH A674 LY A675 LS A676, LA A676, LO A676, LY A676, LW A676 LS A679, LY A679, LG A679 - Hyper Micro SIDELED® LS Y876, LA Y876, LO Y876, LY Y876 LT Y87S - SmartLED LW L88C, LW L88S LB L89C, LB L89S, LG L890 LS L89K, LO L89K, LY L89K LS L896, LA L896, LO L896, LY L896 - TOPLED LS T670, LO T670, LY T670, LG T670, LP T670 LSG T670, LSP T670, LSY T670, LOP T670, LYG T670 LG T671, LOG T671, LSG T671 LB T673, LV T673, LT T673, LW T673 LH T674 LS T676, LA T676, LO T676, LY T676, LB T676, LH T676, LSB T676, LW T676 LB T67C, LV T67C, LT T67C, LS T67K, LO T67K, LY T67K, LW E67C LS E67B, LA E67B, LO E67B, LY E67B, LB E67C, LV E67C, LT E67C LW T67C LS T679, LY T679, LG T679 LS T770, LO T770, LY T770, LG T770, LP T770 LB T773, LV T773, LT T773, LW T773 LH T774 LS E675, LA E675, LY E675, LS T675 LS T776, LA T776, LO T776, LY T776, LB T776 LHGB T686 LT T68C, LB T68C - Hyper Mini TOPLED® LB M676 - Mini TOPLED Santana® LG M470 LS M47K, LO M47K, LY M47K Source: http://www.osram.convergy.de LUXEON: - LUMILED® LXK2-PW12-R00, LXK2-PW12-S00, LXK2-PW14-U00, LXK2-PW14-V00 LXK2-PM12-R00, LXK2-PM12-S00, LXK2-PM14-U00 LXK2-PE12-Q00, LXK2-PE12-R00, LXK2-PE12-S00, LXK2-PE14-T00, LXK2-PE14-U00 LXK2-PB12-K00, LXK2-PB12-L00, LXK2-PB12-M00, LXK2-PB14-N00, LXK2-PB14-P00, LXK2-PB14-Q00 LXK2-PR12-L00, LXK2-PR12-M00, LXK2-PR14-Q00, LXK2-PR14-R00 LXK2-PD12-Q00, LXK2-PD12-R00, LXK2-PD12-S00 LXK2-PH12-R00, LXK2-PH12-S00 LXK2-PL12-P00, LXK2-PL12-Q00, LXK2-PL12-R00 Source: www.luxeon.com KINGBRIGHT: KA-3528ASYC Source: www.kingbright.com
L1 = wuerth-elektronik:WE-CBF: SMD EMI Suppression Ferrite Beads - excellent anti-EMI properties - low DCR - impedances till 3000 ohms - rated current up to 6 A
LOGO2 = OSHW:OSHW_LOGO_6MIL
P1 = TC33X-2-103E:TC33X-2-103E: Cermet 3mm SMT trimmer,0.1W 10k Bourns TC33 Series SMD Cermet Trimmer Resistor with Solder Pad Terminations, 10k?? ??25% 1/10W ??250ppm/??C Top Adjust Source: Datasheet <https://www.bourns.com/pdfs/TC33.pdf>; ALLIED_NUMBER: 70153492; ALLIED_PRICE-STOCK: http://www.alliedelec.com/bourns-tc33x-2-103e/70153492/; ARROW_PART_NUMBER: TC33X-2-103E; ARROW_PRICE-STOCK: https://www.arrow.com/en/products/tc33x-2-103e/bourns; DESCRIPTION: Cermet 3mm SMT trimmer,0.1W 10k Bourns TC33 Series SMD Cermet Trimmer Resistor with Solder Pad Terminations, 10k?? ??25% 1/10W ??250ppm/??C Top Adjust; HEIGHT: mm; MANUFACTURER_NAME: Bourns; MANUFACTURER_PART_NUMBER: TC33X-2-103E; RS_PART_NUMBER: 1673549; RS_PRICE-STOCK: http://uk.rs-online.com/web/p/products/1673549
PC1 PC2 = rcl:CPOL-EU: POLARIZED CAPACITOR, European symbol; SPICEPREFIX: C
PS-ON = SparkFun-Connectors:CONN_01: Single connection point. Often used as Generic Header-pin footprint for 0.1 inch spaced/style header connections On any of the 0.1 inch spaced packages, you can populate with these: Break Away Headers - Straight <https://www.sparkfun.com/products/116> (PRT-00116) Break Away Male Headers - Right Angle <https://www.sparkfun.com/products/553> (PRT-00553) Female Headers <https://www.sparkfun.com/products/115> (PRT-00115) Break Away Headers - Machine Pin <https://www.sparkfun.com/products/117> (PRT-00117) Break Away Female Headers - Swiss Machine Pin <https://www.sparkfun.com/products/743> (PRT-00743) This device is also useful as a general connection point to wire up your design to another part of your project. Our various solder wires solder well into these plated through hole pads. Hook-Up Wire - Assortment (Stranded, 22 AWG) <https://www.sparkfun.com/products/11375> (PRT-11375) Hook-Up Wire - Assortment (Solid Core, 22 AWG) <https://www.sparkfun.com/products/11367> (PRT-11367) View the entire wire category on our website here <https://www.sparkfun.com/categories/141> Special notes: SMTSO-256-ET is a "flush mount" nut for a 4-40 screw. We mostly use this on specialty testbeds; it is a nice way to connect hardware to your PCB at an adjustable hieght. Also note, the SNAP packages are for using a snappable style connector. We sell a baggie of snaps and they are also used on two LilyPad designs: Snap Assortment - 30 pack (male and female) <https://www.sparkfun.com/products/11347> (DEV-11347) LilyPad Arduino SimpleSnap <https://www.sparkfun.com/products/10941> (DEV-10941) LilyPad SimpleSnap Protoboard <https://www.sparkfun.com/products/10940> (DEV-10940)
Q1 Q2 = transistor-power:IRF512: N-CHANNEL MOS FET
Q3 Q4 = SI4946CDY-T1-GE3:SI4946CDY-T1-GE3
R1 R2 = SmartPrj:R-EU_: RESISTOR, European symbol
R11 R12 R21 R22 R31-R35 R40-R43 R61 R62 R71 R72 = adafruit:R-US_: RESISTOR, American symbol
RESET = switch-omron:31-XX: OMRON SWITCH; MPN: B3F-3100; OC_FARNELL: 959704; OC_NEWARK: 36M3582
RN3 RN4 = resistor-dil:4R-N: Array Chip Resistor Source: RS Component / Phycomp; OC_FARNELL: unknown; OC_NEWARK: unknown
U$1-U$5 = TMC2130:TMC2130BREAKOUT
X1 = con-508-gen:2-PIN
X2 = SmartPrj:PN61729: BERG USB connector
X3 = con-508-gen:4-PIN
Y1 = SmartPrj:RESONATOR
Y2 = SmartPrj:XTAL/S: CRYSTAL
Z1 Z2 = varistor:VARISTOR: VARISTOR

## Net classes
1 power: width 0.203 mm, drill 0.406 mm, clearance 0.203 mm
2 gnd: width 0.203 mm, drill 0.406 mm, clearance 0.203 mm
3 power usb: width 0.203 mm, drill 0.406 mm, clearance 0.203 mm

## Board
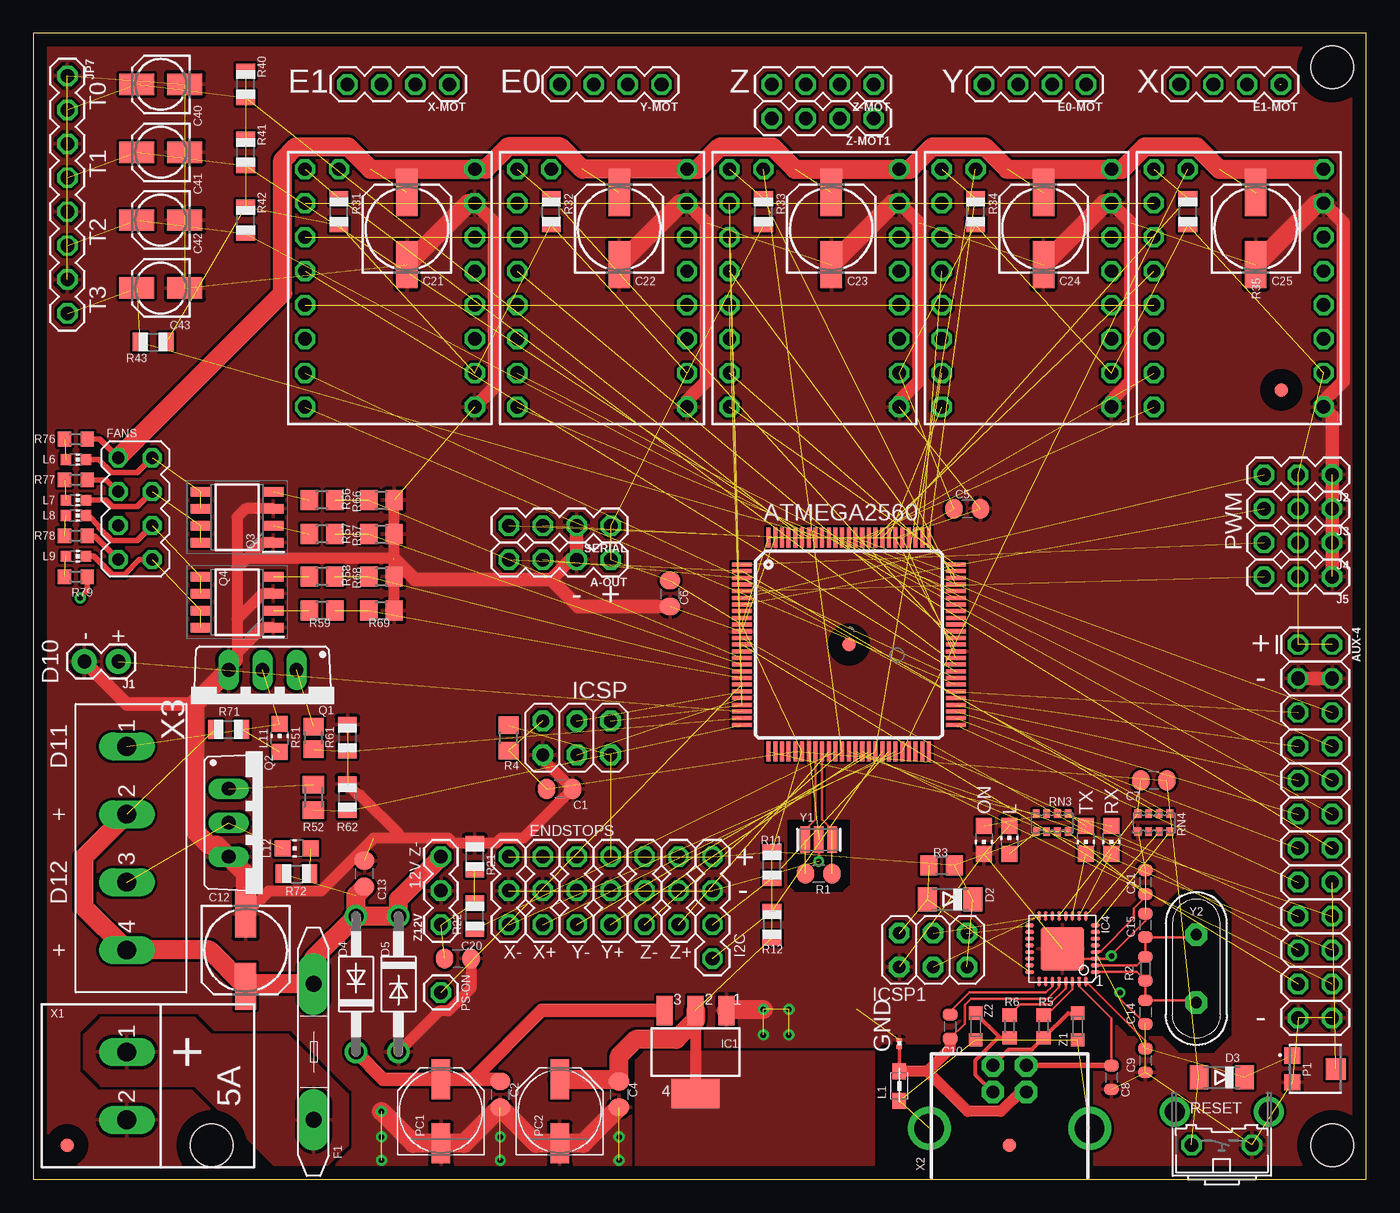
[diagram p1: board, top side]
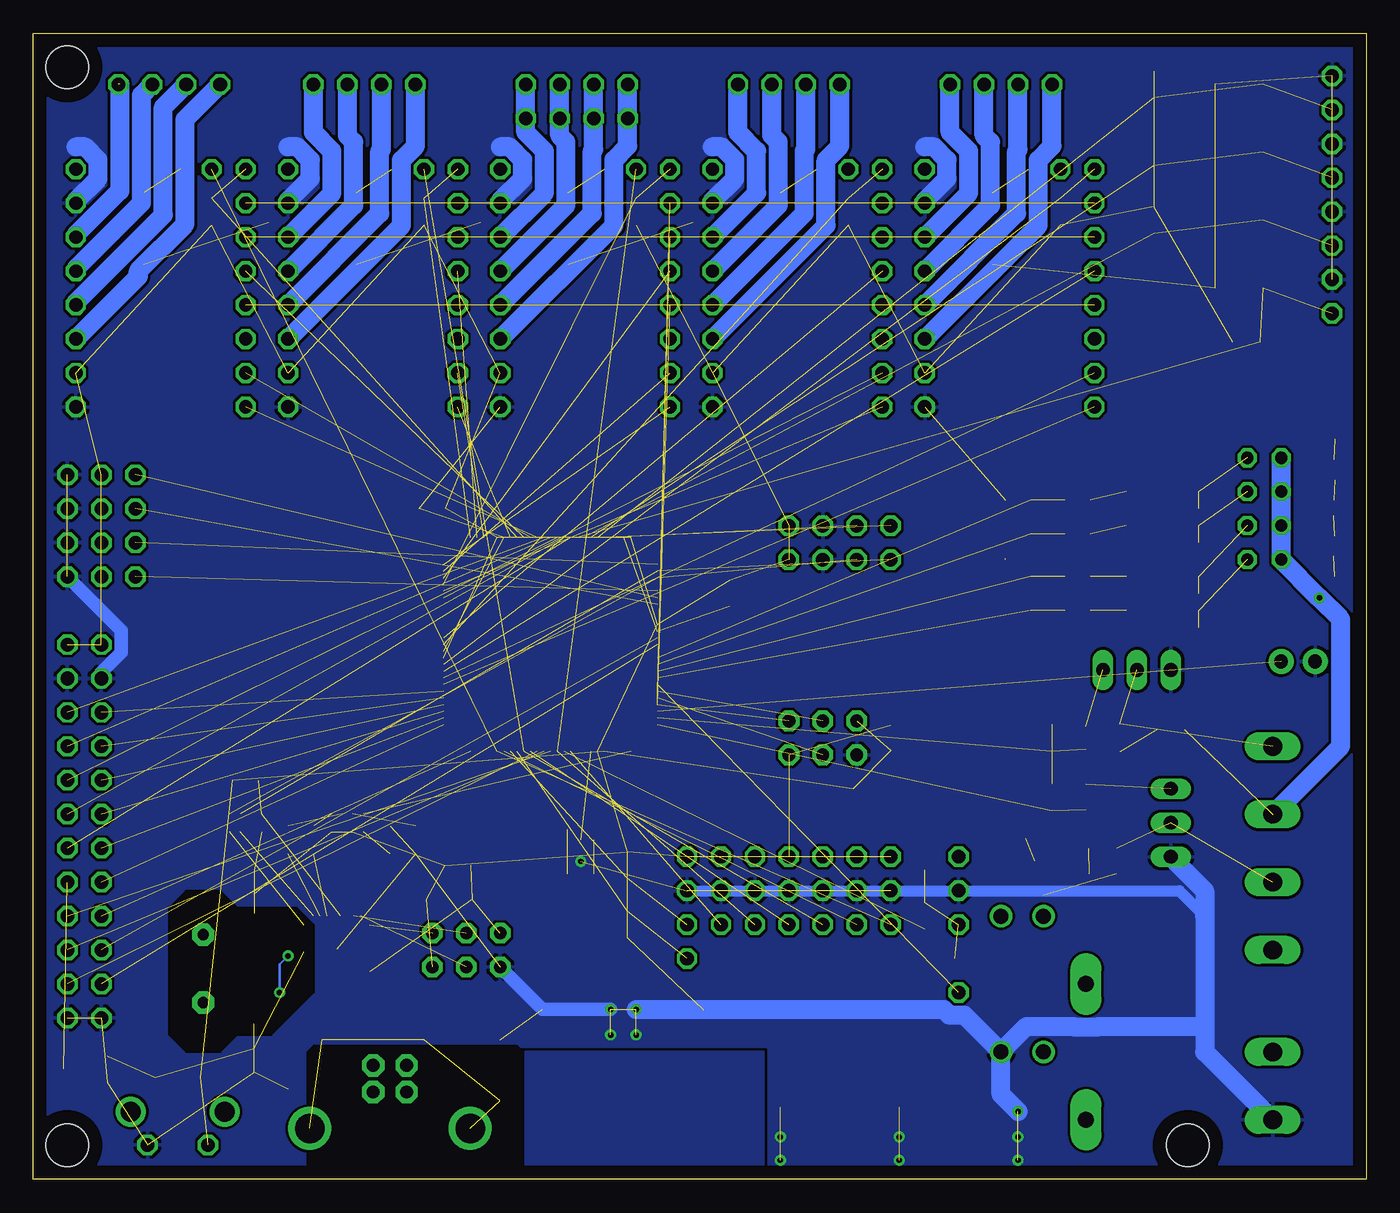
[diagram p2: board, bottom side, seen from below]

Size 99.69 x 85.72 mm. Coordinates in mm from the lower left corner, seen from the top.
Outline: 0,0 99.69,0 99.69,85.72 0,85.72 0,0
Copper layers (1*16): Top 0.035mm / dielectric 1.5mm / Bottom 0.035mm
Design rules "default *": minimum track width 6mil, minimum drill 0.35mm, track to track 8mil, track to pad 8mil, pad to pad 8mil, via to via 8mil, smd to smd 8mil, copper to edge 40mil, drill to drill 6mil, minimum pad ring 10mil, minimum via ring 8mil, stop-mask expansion 4mil, vias tented up to drill 0mil, thermal gap 10mil
Holes 3.2 mm at 97.16,2.54 97.16,83.19 13.34,2.54 -12.06,44.45

### Footprints (pad centres in the part's own frame; a part is rotated, then mirrored left to right if it is on the bottom)
1X04_SMALL = drill 1.016 octagon: 1 0,0; 2 2.54,0; 3 5.08,0; 4 7.62,0
TQFP100 = smd 1.5 x 0.3: 1 -8,6; 2 -8,5.5; 3 -8,5; 4 -8,4.5; 5 -8,4; 6 -8,3.5; 7 -8,3; 8 -8,2.5; 9 -8,2; 10 -8,1.5; 11 -8,1; 12 -8,0.5; 13 -8,0; 14 -8,-0.5; 15 -8,-1; 16 -8,-1.5; 17 -8,-2; 18 -8,-2.5; 19 -8,-3; 20 -8,-3.5; 21 -8,-4; 22 -8,-4.5; 23 -8,-5; 24 -8,-5.5; 25 -8,-6; 51 8,-6; 52 8,-5.5; 53 8,-5; 54 8,-4.5; 55 8,-4; 56 8,-3.5; 57 8,-3; 58 8,-2.5; 59 8,-2; 60 8,-1.5; 61 8,-1; 62 8,-0.5; 63 8,0; 64 8,0.5; 65 8,1; 66 8,1.5; 67 8,2; 68 8,2.5; 69 8,3; 70 8,3.5; 71 8,4; 72 8,4.5; 73 8,5; 74 8,5.5; 75 8,6 | smd 0.3 x 1.5: 26 -6,-8; 27 -5.5,-8; 28 -5,-8; 29 -4.5,-8; 30 -4,-8; 31 -3.5,-8; 32 -3,-8; 33 -2.5,-8; 34 -2,-8; 35 -1.5,-8; 36 -1,-8; 37 -0.5,-8; 38 0,-8; 39 0.5,-8; 40 1,-8; 41 1.5,-8; 42 2,-8; 43 2.5,-8; 44 3,-8; 45 3.5,-8; 46 4,-8; 47 4.5,-8; 48 5,-8; 49 5.5,-8; 50 6,-8; 76 6,8; 77 5.5,8; 78 5,8; 79 4.5,8; 80 4,8; 81 3.5,8; 82 3,8; 83 2.5,8; 84 2,8; 85 1.5,8; 86 1,8; 87 0.5,8; 88 0,8; 89 -0.5,8; 90 -1,8; 91 -1.5,8; 92 -2,8; 93 -2.5,8; 94 -3,8; 95 -3.5,8; 96 -4,8; 97 -4.5,8; 98 -5,8; 99 -5.5,8; 100 -6,8
2X12_SMALL = drill 1.016 octagon: 1 0,0; 2 0,2.54; 3 2.54,0; 4 2.54,2.54; 5 5.08,0; 6 5.08,2.54; 7 7.62,0; 8 7.62,2.54; 9 10.16,0; 10 10.16,2.54; 11 12.7,0; 12 12.7,2.54; 13 15.24,0; 14 15.24,2.54; 15 17.78,0; 16 17.78,2.54; 17 20.32,0; 18 20.32,2.54; 19 22.86,0; 20 22.86,2.54; 21 25.4,0; 22 25.4,2.54; 23 27.94,0; 24 27.94,2.54
C0805RND = smd 1.3 x 1.5: 1 -0.977,0; 2 0.977,0
C0603-ROUND = smd 0.898 x 1.1: 1 -0.889,0; 2 0.889,0
153CLV-0605 = smd 3.5 x 1.6: + 2.7,0; - -2.7,0
153CLV-0405 = smd 2.6 x 1.6: + 1.8,0; - -1.8,0
MINIMELF = smd 1.4 x 1.8: A 1.7,0; C -1.7,0
DO41-10 = drill 1.118: A 5.08,0; C -5.08,0
MFR500 = drill 1.2 pad 2.3 long: 1 -5.08,0; 2 5.08,0
2X4 = drill 0.9 pad 1.422 octagon: 1 -3.81,-1.27; 2 -3.81,1.27; 3 -1.27,-1.27; 4 -1.27,1.27; 5 1.27,-1.27; 6 1.27,1.27; 7 3.81,-1.27; 8 3.81,1.27
FIDUCIA-MOUNT = smd 1.016 x 1.016: P$1 0,0
R0201 = smd 0.28 x 0.43: 1 -0.255,0; 2 0.255,0
SOT223 = smd 1.219 x 2.235: 1 -2.311,-3.099; 2 0,-3.099; 3 2.311,-3.099 | smd 3.6 x 2.2: 4 0,3.099
MLF32 = smd 0.7 x 0.28: 1 -2.45,1.75; 2 -2.45,1.25; 3 -2.45,0.75; 4 -2.45,0.25; 5 -2.45,-0.25; 6 -2.45,-0.75; 7 -2.45,-1.25; 8 -2.45,-1.75; 17 2.45,-1.75; 18 2.45,-1.25; 19 2.45,-0.75; 20 2.45,-0.25; 21 2.45,0.25; 22 2.45,0.75; 23 2.45,1.25; 24 2.45,1.75 | smd 0.28 x 0.7: 9 -1.75,-2.45; 10 -1.25,-2.45; 11 -0.75,-2.45; 12 -0.25,-2.45; 13 0.25,-2.45; 14 0.75,-2.45; 15 1.25,-2.45; 16 1.75,-2.45; 25 1.75,2.45; 26 1.25,2.45; 27 0.75,2.45; 28 0.25,2.45; 29 -0.25,2.45; 30 -0.75,2.45; 31 -1.25,2.45; 32 -1.75,2.45 | smd 3.254 x 3.254: 33 0,0
2X03 = drill 0.95 pad 1.55 octagon: 1 -2.54,-1.27; 2 -2.54,1.27; 3 0,-1.27; 4 0,1.27; 5 2.54,-1.27; 6 2.54,1.27
1X02 = drill 1.016 pad 1.88: 1 0,0; 2 2.54,0
1X03_SMALL = drill 1.016 octagon: 1 0,0; 2 2.54,0; 3 5.08,0
1X08_SMALL = drill 1.016 octagon: 1 0,0; 2 2.54,0; 3 5.08,0; 4 7.62,0; 5 10.16,0; 6 12.7,0; 7 15.24,0; 8 17.78,0
CHIP-LED0805 = smd 1.2 x 1.2: A 0,-1.05; C 0,1.05
0805 = smd 1.2 x 1: 1 -1.1,0; 2 1.1,0
CHIP-LED0603 = smd 0.8 x 0.8: A 0,-0.75; C 0,0.75
TC33X-2_1 = smd 1.2 x 1.2: 1 -1,-1.7; 3 1,-1.7 | smd 1.6 x 1.5: 2 0,1.55
PANASONIC_D = smd 3 x 1.4: + 2.4,0; - -2.4,0
1X01_SMALL = drill 1.016 octagon: 1 0,0
TO220BV = drill 1.016 long: D 0,-2.54; G -2.54,-2.54; S 2.54,-2.54
SOIC127P600X175-8N = smd 1.525 x 0.7: 1 -2.712,1.905; 2 -2.712,0.635; 3 -2.712,-0.635; 4 -2.712,-1.905; 5 2.712,-1.905; 6 2.712,-0.635; 7 2.712,0.635; 8 2.712,1.905
R0805RND = smd 1.3 x 1.5: 1 -0.977,0; 2 0.977,0
R0603-ROUND = smd 0.898 x 1.1: 1 -0.889,0; 2 0.889,0
R0805 = smd 1.3 x 1.5: 1 -0.95,0; 2 0.95,0
R0603 = smd 1 x 1.1: 1 -0.85,0; 2 0.85,0
R0805' = smd 1.1 x 1.4: 1 -1,0; 2 1,0
R0805'' = smd 1.3 x 1.5: 1 -0.85,0; 2 0.85,0
M0805 = smd 1.3 x 1.6: 1 -0.95,0; 2 0.95,0
B3F-31XX = drill 1.016 octagon: 1 -2.261,-1.245; 2 2.261,-1.245 | drill 1.499 pad 2.159: 3 -3.505,1.245; 4 3.505,1.245
CAY16 = smd 0.5 x 0.65: 1 -1.2,-0.675; 2 -0.4,-0.675; 3 0.4,-0.675; 4 1.2,-0.675; 5 1.2,0.675; 6 0.4,0.675; 7 -0.4,0.675; 8 -1.2,0.675
TMC2130BREAKOUT = drill 1 octagon: 3 13.97,13.97; CFG-0 13.97,11.43; CFG-1 13.97,3.81; CFG-2 13.97,6.35; CFG-3 13.97,8.89; CFG-6 13.97,1.27; DIR 13.97,19.05; GND 1.27,3.81; GND@0 1.27,19.05; IREF 11.43,1.27; OA1 1.27,11.43; OA2 1.27,13.97; OB1 1.27,8.89; OB2 1.27,6.35; STEP 13.97,16.51; VIO 1.27,16.51; VM 1.27,1.27
2-PIN = drill 1.397 long: 1 -2.54,5.08; 2 2.54,5.08
PN61729-NOSILK = drill 0.95 pad 1.676 octagon: 1 1.25,4.71; 2 -1.25,4.71; 3 -1.25,2.71; 4 1.25,2.71 | drill 2.2: P$1 -6,0; P$2 6,0
4-PIN = drill 1.397 long: 1 -7.62,5.08; 2 -2.54,5.08; 3 2.54,5.08; 4 7.62,5.08
RESONATOR = smd 0.7 x 2: 1 -1,0; 2 0,0; 3 1,0
QS = drill 0.85 pad 1.676 octagon: 1 -2.54,0; 2 2.54,0
CT/CN0603 = smd 1 x 1: 1 -1,0; 2 1,0

### Placement (x,y rotation side)
A-OUT  43.18,46.35 180 top
ATMEGA2560  61,40 0 top
AUX-4  94.61,40.01 270 top
C1  39.37,29.21 0 top
C2  34.92,6.35 270 top
C4  43.81,6.35 270 top
C5  69.85,50.16 0 top
C6  47.62,43.81 270 top
C7  83.82,29.84 0 top
C8  80.64,7.62 270 top
C9  83.19,8.89 270 top
C10  68.58,11.43 270 top
C11  83.19,22.23 90 top
C12  15.88,17.14 270 top
C13  24.77,22.86 90 top
C14  83.19,12.5 270 top
C15  83.19,19 90 top
C20  31.75,16.51 0 top
C21  27.94,71.12 90 top
C22  43.81,71.12 90 top
C23  59.69,71.12 90 top
C24  75.56,71.12 90 top
C25  91.44,71.12 90 top
C40  9.53,81.92 180 top
C41  9.53,76.83 180 top
C42  9.53,71.75 180 top
C43  9.53,66.67 180 top
D2  68.58,20.95 180 top
D3  88.9,7.62 180 top
D4  24.13,14.61 90 top
D5  27.3,14.61 270 top
E0-MOT  78.74,81.92 180 top
E1-MOT  93.34,81.92 180 top
F1  20.95,9.53 270 top
FANS  7.62,50.16 270 top
FD1  61,40 0 top
FD2  2.54,2.54 0 top
FD3  93.34,59.05 0 top
FD4  73.03,2.54 0 top
GND  64.77,10.16 90 top
I2C  50.8,24.13 270 top
IC1  49.53,9.53 180 top
IC4  76.98,17.25 180 top
ICSP  40.64,33.02 180 top
ICSP1  67.31,17.14 180 top
J1  6.35,38.73 180 top
J2  97.16,52.7 180 top
J3  97.16,50.16 180 top
J4  97.16,47.62 180 top
J5  97.16,45.09 180 top
JP7  2.54,82.55 270 top
L  73.03,25.4 0 top
L1  64.77,6.99 270 top
L6  3.17,53.85 270 top
L7  3.17,50.8 270 top
L8  3.17,49.66 270 top
L9  3.17,46.61 270 top
L11  18.41,33.02 0 top
L12  19.68,24.77 90 top
LOGO2  -18.92,76.2 0 top  (outside the outline)
ON  71.12,25.4 180 top
P1  95.89,8.26 270 top
PC1  30.48,5.08 90 top
PC2  39.37,5.08 90 top
PS-ON  30.48,13.97 270 top
Q1  17.14,35.56 180 top
Q2  17.14,26.67 270 top
Q3  15.24,49.53 180 top
Q4  15.24,43.18 180 top
R1  58.75,22.86 180 top
R2  83.19,15.75 90 top
R3  67.94,23.5 0 top
R4  35.56,33.02 90 top
R5  75.56,11.43 270 top
R6  73.03,11.43 270 top
R11  3.3K  [R0805']  55.24,23.5 90 top
R12  3.3K  [R0805']  55.24,19.05 270 top
R21  10k  [R0805']  33.02,24.13 270 top
R22  15k  [R0805']  33.02,19.68 90 top
R31  10k  [R0805']  22.86,72.39 90 top
R32  10k  [R0805']  38.73,72.39 90 top
R33  10k  [R0805']  54.61,72.39 90 top
R34  10k  [R0805']  70.48,72.39 90 top
R35  10k  [R0805']  86.36,72.39 90 top
R40  4.7K  [R0805']  15.88,81.92 90 top
R41  4.7K  [R0805']  15.88,76.83 90 top
R42  4.7K  [R0805']  15.88,71.75 90 top
R43  4.7K  [R0805']  8.96,62.64 0 top
R51  10r  [R0805'']  20.95,33.02 90 top
R52  20.95,28.57 90 top
R56  21.59,50.8 180 top
R57  21.59,48.26 180 top
R58  21.59,45.09 180 top
R59  21.59,42.55 180 top
R61  100k  [R0805']  23.5,33.02 90 top
R62  100k  [R0805']  23.5,28.57 90 top
R66  26.04,50.8 0 top
R67  26.04,48.26 0 top
R68  26.04,45.09 0 top
R69  26.04,42.55 0 top
R71  1.8K  [R0805']  14.61,33.66 0 top
R72  1.8K  [R0805']  19.68,22.86 0 top
R76  3.17,55.37 0 top
R77  3.17,52.32 0 top
R78  3.17,48.13 0 top
R79  3.17,45.09 0 top
RESET  88.9,3.81 0 top
RN3  76.2,26.67 0 top
RN4  83.82,26.67 180 top
RX  80.64,25.4 180 top
SERIAL  43.18,48.9 180 top
TX  78.74,25.4 180 top
U$1  34.29,76.83 180 top
U$2  50.16,76.83 180 top
U$3  66.04,76.83 180 top
U$4  97.79,76.83 180 top
U$5  81.92,76.83 180 top
X1  1.91,6.99 270 top
X2  73.03,3.81 0 top
X3  1.91,24.77 270 top
X+  38.1,19.05 90 top
X-  35.56,19.05 90 top
X-MOT  31.11,81.92 180 top
Y1  58.75,25.4 0 top
Y2  87,15.75 270 top
Y+  43.18,19.05 90 top
Y-  40.64,19.05 90 top
Y-MOT  46.99,81.92 180 top
Z1  78.11,11.43 90 top
Z2  70.48,11.43 90 top
Z12V  30.48,19.05 90 top
Z+  48.26,19.05 90 top
Z-  45.72,19.05 90 top
Z-MOT  62.87,81.92 180 top
Z-MOT1  62.87,79.38 180 top

### Tracks (layer width: path | path; a pad name or v marks a point on that pad's centre or on a via)
12V-IN
  pour Top: 3.81,10.79 5.08,12.06 12.06,12.06 13.34,10.79 19.05,10.79 23.5,6.35 23.5,2.54 21.59,0.64 18.41,0.64 12.06,6.99 5.08,6.99 3.81,8.26
+5V  (50 unrouted)
  Top 0.203: C11.1 83.19,21.11 82.33,20.25 82.33,19.55 79.84,17.05 79.48,17.05 IC4.4 | IC4.32 83.19,10.35 C9.1
  Top 0.813: IC1.2 IC1.4
  Top 1.422: PC2.+ 43.66,7.48 C4.1 43.81,9.23 45.05,10.46 48.08,10.46 49.53,11.91 IC1.2
  pour Bottom (no thermals): 45.09,0 62.87,0 62.87,9.53 45.09,9.53
  pour Top (no thermals): 45.09,0 62.87,0 62.87,9.53 45.72,9.53 45.09,8.89
+12V  (via drill 0.41)  (7 unrouted)
  Top 0.406: FANS.7 4.57,48.13 R78.2 | FANS.3 5.46,52.32 R77.2 | FANS.1 4.95,55.37 R76.2 | R79.2 4.03,44.03 v3.49,43.5
  Top 1.422: D4.A 20.95,16.51 F1.1 16.04,14.61 C12.+ 13.18,17.14 X3.4 3.81,20.32 3.81,24.13 X3.2 | D4.A D5.C 27.3,20.95 Z12V.3 | D4.A 24.13,21.25 C13.1 | U$4.VM 88.72,75.56 87.05,77.23 83.13,77.23 81.46,75.56 U$5.VM 72.84,75.56 71.18,77.23 67.25,77.23 65.59,75.56 U$3.VM 56.97,75.56 55.3,77.23 51.38,77.23 49.71,75.56 U$2.VM 41.09,75.56 39.43,77.23 35.5,77.23 33.84,75.56 U$1.VM 25.22,75.56 23.55,77.23 19.63,77.23 18.65,76.26 18.65,66.28 FANS.1
  Bottom 1.422: FANS.1 FANS.3 FANS.5 FANS.7 v3.49,43.5 1.91,41.91 1.91,32.38 X3.2
A0  (1 unrouted)
A1  (1 unrouted)
A2  (3 unrouted)
A3  (3 unrouted)
A4  (3 unrouted)
A5  (3 unrouted)
A6  (1 unrouted)
A7  (1 unrouted)
A8  (1 unrouted)
A9  (1 unrouted)
A10  (1 unrouted)
A11  (1 unrouted)
A12  (1 unrouted)
A13  (1 unrouted)
A14  (2 unrouted)
A15  (1 unrouted)
CTRST  (1 unrouted)
D0  (2 unrouted)
D1  (2 unrouted)
D2  (1 unrouted)
D3  (1 unrouted)
D4  (1 unrouted)
D5  (1 unrouted)
D6  (2 unrouted)
D7  (2 unrouted)
D8  (2 unrouted)
D9  (2 unrouted)
D10  (1 unrouted)
D11  (2 unrouted)
D12  (2 unrouted)
D13(LED)  (1 unrouted)
D14  (1 unrouted)
D15  (2 unrouted)
D16  (1 unrouted)
D17  (1 unrouted)
D18  (2 unrouted)
D19  (1 unrouted)
D22  (1 unrouted)
D23  (1 unrouted)
D24  (2 unrouted)
D25  (1 unrouted)
D26  (1 unrouted)
D27  (1 unrouted)
D28  (2 unrouted)
D29  (1 unrouted)
D30  (2 unrouted)
D31  (1 unrouted)
D32  (1 unrouted)
D33  (1 unrouted)
D34  (1 unrouted)
D35  (1 unrouted)
D36  (1 unrouted)
D37  (1 unrouted)
D38  (1 unrouted)
D39  (1 unrouted)
D40  (1 unrouted)
D41  (1 unrouted)
D42  (2 unrouted)
D43  (1 unrouted)
D44  (1 unrouted)
D45  (1 unrouted)
D46  (1 unrouted)
D47  (2 unrouted)
D48  (1 unrouted)
D49  (1 unrouted)
D53  (1 unrouted)
D+
  Top 0.305: X2.3 70.48,7.81 70.48,8.92 72.15,10.58 R6.2 72.33,10.58 Z2.2
D-
  Top 0.305: X2.2 72.97,9.71 74.7,9.71 R5.2 77.42,12.43 Z1.2
DTR  (2 unrouted)
E0-1
  Bottom 1.422: E0-MOT.1 78.74,78.32 77.35,76.93 77.35,73.78 U$5.OB2
E0-2
  Bottom 1.422: E0-MOT.2 76.2,78.08 75.72,77.6 75.72,72.86 U$5.OB1
E0-3
  Bottom 1.422: U$5.OA1 73.78,72.27 73.78,76.93 73.66,77.05 E0-MOT.3
E0-4
  Bottom 1.422: U$5.OA2 72.15,71.36 72.15,76.26 71.12,77.29 E0-MOT.4
E1-1  (1 unrouted)
  Bottom 1.422: U$4.OB2 96.52,70.67 93.23,73.96 93.23,81.92
E1-2
  Bottom 1.422: U$4.OB1 96.52,68.13 91.6,73.05 91.6,81.12 E1-MOT.2
E1-3
  Bottom 1.422: E1-MOT.3 89.97,80.2 89.97,72.13 96.52,65.59 U$4.OA1
E1-4
  Bottom 1.422: U$4.OA2 91.84,67.55 91.84,67.97 88.35,71.46 88.35,79.29 E1-MOT.4
GND  (via drill 0.41)  (53 unrouted)
  Top 0.203: Y1.2 v58.75,23.78 | IC4.33 77.73,16.5 IC4.3 80.43,16.5 v80.64,16.71 80.64,16.79 83.19,19.33 C15.2 | C14.2 81.28,13.52 v81.28,13.97
  Top 0.813: ICSP.6 38.1,31.46 C1.2 36.64,25.5 34.99,25.5 34.62,25.13 R21.1 31.42,25.13 31.05,25.5 27.3,25.5 | C12.- 17.58,21.55 21.49,21.55 25.44,25.5 27.3,25.5 | R62.2 24.34,28.73 24.45,28.73 27.3,25.88 27.3,25.5 | D5.A 30.38,12.6 31.05,12.6 32.73,14.28 C20.2 | Q3.3 15.88,50.16 15.24,49.53 15.24,45.72 | Q1.S 15.24,38.73 15.24,39.37 | 15.24,45.72 15.24,41.91 | 15.24,41.91 15.24,39.37 | Q4.1 17.14,41.27 15.24,39.37 | Q4.3 17.14,43.81 15.24,41.91 | Q3.1 17.14,47.62 15.96,46.45 | R69.2 R68.2 26.98,46.35 | 15.96,46.45 26.98,46.45 R67.2 R66.2 | 15.96,46.45 15.24,45.72
  Top 1.016: U$1.GND@0 34.48,59.25 34.48,71.56 U$1.GND | U$2.GND@0 48.9,58.25 50.36,59.72 50.36,71.56 U$2.GND | U$3.GND@0 64.77,58.25 66.23,59.72 66.23,71.56 U$3.GND | U$5.GND@0 80.64,58.25 82.11,59.72 82.11,71.56 U$5.GND | U$4.GND 97.98,71.56 97.98,59.72 96.52,58.25 U$4.GND@0 97.16,57.15 J5.1 | AUX-4.3 AUX-4.4 | SERIAL.2 A-OUT.2 40.18,46.35 38.71,44.88 | 38.71,44.88 28.55,44.88 26.98,46.45 | C6.2 40.75,42.84 38.71,44.88 | J1.2 6.99,35.56 12.06,35.56
  Top 1.422: C12.- 15.88,22.86 Q2.S 13.74,24.99 13.15,24.99 12.06,26.08 12.06,35.56 Q1.S | C4.2 41.12,2.68 PC2.- 37.62,2.68 C2.2 32.23,2.68 PC1.- 28.43,2.68 v26.04,5.08 | IC1.1 51.92,12.7 v54.61,12.7 | C21.- 32.55,73.03 U$1.GND | C22.- 48.42,73.03 U$2.GND | C23.- 64.3,73.03 U$3.GND | C24.- 80.17,73.03 U$5.GND | C25.- 96.05,73.03 U$4.GND
  Bottom 0.203: v81.28,13.97 81.28,16.08 v80.64,16.71
  Bottom 0.813: I2C.2 Z12V.2 13.97,21.59 12.06,19.68
  Bottom 1.016: AUX-4.3 94.61,37.92 93.14,39.4 93.14,41.07 J5.1 | v56.52,12.7 61.59,12.7 ICSP1.6
  Bottom 1.422: 14.01,24.13 Q2.S 12.06,21.59 12.06,19.68 12.06,11.43 | 12.06,11.43 12.06,9.53 X1.2 | v54.61,12.7 31.58,12.7 31.17,12.29 30.07,12.29 D5.A | v26.04,5.08 27.3,6.35 D5.A | D5.A 25.4,11.43 21.85,11.43 21.81,11.39 20.1,11.39 20.06,11.43 12.06,11.43 | 48.9,77.23 48.2,77.23 47.23,76.26 47.23,74.87 48.9,73.21 U$2.GND | 64.77,77.23 64.08,77.23 63.1,76.26 63.1,74.87 64.77,73.21 U$3.GND | 80.64,77.23 79.95,77.23 78.98,76.26 78.98,74.87 80.64,73.21 U$5.GND | 96.52,77.23 95.83,77.23 94.85,76.26 94.85,74.87 96.52,73.21 U$4.GND | 33.02,77.23 32.33,77.23 31.35,76.26 31.35,74.87 33.02,73.21 U$1.GND
  other vias: 34.92,3.17 34.92,1.42 43.81,3.17 43.81,1.42 26.04,3.17 26.04,1.42 54.61,10.79 56.52,10.79
  pour Top (rank 2): 99.06,0 80.01,0 79.38,0.64 79.38,9.53 78.74,10.16 63.5,10.16 62.87,9.53 62.87,0.64 62.23,0 0.64,0 0,0.64 0,85.09 0.64,85.72 99.06,85.72 99.69,85.09 99.69,0.64
  pour Bottom (rank 2): 99.06,0 80.01,0 79.38,0.64 79.38,9.53 78.74,10.16 63.5,10.16 62.87,9.53 62.87,0.64 62.23,0 0.64,0 0,0.64 0,85.09 0.64,85.72 99.06,85.72 99.69,85.09 99.69,0.64
  cutout Top: 85.72,21.59 88.27,21.59 89.53,20.32 89.53,10.79 88.27,9.53 85.72,9.53 84.45,10.79 81.92,10.79 78.74,13.97 78.74,19.05 80.01,20.32 84.45,20.32
  cutout Bottom: 85.72,21.59 88.27,21.59 89.53,20.32 89.53,10.79 88.27,9.53 85.72,9.53 84.45,10.79 81.92,10.79 78.74,13.97 78.74,15.24 78.74,19.05 80.01,20.32 84.45,20.32
  cutout Top: 56.5,26.82 56.5,22.08 57,21.58 60.5,21.58 61,22.08 61,26.82
L  (1 unrouted)
M8RXD  (1 unrouted)
M8TXD  (1 unrouted)
MISO  (6 unrouted)
MISO2  (1 unrouted)
MOSI  (6 unrouted)
MOSI2  (1 unrouted)
N$1  (1 unrouted)
N$2  (1 unrouted)
N$3  (3 unrouted)
N$4  (1 unrouted)
N$5  (1 unrouted)
N$107  (1 unrouted)
N$108  (1 unrouted)
ON  (1 unrouted)
Q1-D  (2 unrouted)
Q1-G  (1 unrouted)
Q2-D  (2 unrouted)
Q2-G  (1 unrouted)
Q6-D  (2 unrouted)
  Top 0.406: L6.C 4.9,53.85 5.89,52.86 7.77,52.86 FANS.2
Q6-G  (1 unrouted)
Q7-D  (2 unrouted)
  Top 0.406: L7.C 5.4,50.8 5.89,50.32 7.77,50.32 FANS.4
Q7-G  (1 unrouted)
Q8-D  (2 unrouted)
  Top 0.406: L8.C 4.13,49.66 4.93,48.85 4.93,48.73 5.89,47.78 7.77,47.78 FANS.6
Q8-G  (1 unrouted)
Q9-D  (2 unrouted)
  Top 0.406: L9.C 4.51,46.61 5.89,45.24 6.81,45.24 7.93,46.35 FANS.8
Q9-G  (1 unrouted)
RD+
  Top 0.203: R6.1 73.83,13.09 75.56,13.09 75.94,13.09 76.02,13.09 77.23,14.29 IC4.29
RD-
  Top 0.203: R5.1 75.96,12.68 76.19,12.68 77.73,14.22 IC4.30
RESET  (6 unrouted)
RESET2  (3 unrouted)
RX  (1 unrouted)
RXL  (1 unrouted)
SCK  (6 unrouted)
SCK2  (1 unrouted)
SCL  (2 unrouted)
SDA  (2 unrouted)
TX  (1 unrouted)
TXL  (1 unrouted)
UGND
  Top 0.203: C10.2 69.68,11.64 69.68,13.06 70.11,13.49 75.85,13.49 76.73,14.37 IC4.28
  Top 0.254: L1.1 GND.1
  Top 0.813: 66.89,8.09 69.91,5.07 72.38,5.07 73.82,6.52 X2.4 | 66.89,8.09 L1.1 | 66.89,8.09 68.58,9.77 C10.2
USBVCC
  Top 0.203: C8.1 80.64,12.03 78.23,14.45 IC4.31
  Top 0.406: X2.1 C8.1
USHIELD  (4 unrouted)
VIN
  Top 1.016: D4.C 26.18,7.48 PC1.+ | PC1.+ 34.77,7.48 C2.1 | PC1.+ 32.88,7.48 38.02,12.62 IC1.3
VUCAP
  Top 0.203: IC4.27 76.23,14.45 75.75,13.97 70.02,13.97 68.58,12.53 C10.1
X-1
  Bottom 1.422: X-MOT.1 31.11,78.32 29.73,76.93 29.73,73.78 U$1.OB2
X-2
  Bottom 1.422: X-MOT.2 28.57,78.08 28.1,77.6 28.1,72.86 U$1.OB1
X-3
  Bottom 1.422: U$1.OA1 26.15,72.27 26.15,76.93 26.04,77.05 X-MOT.3
X-4
  Bottom 1.422: U$1.OA2 24.53,71.36 24.53,76.26 23.5,77.29 X-MOT.4
XT1
  Top 0.203: IC4.1 82.55,15.5 R2.1 C14.1 86.82,13.39 Y2.2
XT2
  Top 0.203: IC4.2 82.55,16 R2.2 C15.1 86.82,18.11 Y2.1
XTAL1  (1 unrouted)
  Top 0.203: Y1.3 59.75,26.18 59,26.93 ATMEGA2560.34
XTAL2  (1 unrouted)
  Top 0.203: Y1.1 57.75,26.18 58.5,26.93 ATMEGA2560.33
Y-1
  Bottom 1.422: U$2.OB2 45.6,73.78 45.6,76.93 46.99,78.32 Y-MOT.1
Y-2
  Bottom 1.422: U$2.OB1 43.98,72.86 43.98,77.6 44.45,78.08 Y-MOT.2
Y-3
  Bottom 1.422: U$2.OA1 42.03,72.27 42.03,76.93 41.91,77.05 Y-MOT.3
Y-4
  Bottom 1.422: Y-MOT.4 39.37,77.29 40.4,76.26 40.4,71.36 U$2.OA2
Z-1
  Bottom 1.422: U$3.OB2 61.48,73.78 61.48,76.93 62.87,78.32 Z-MOT1.1 Z-MOT.1
Z-2
  Bottom 1.422: U$3.OB1 59.85,72.86 59.85,77.6 60.33,78.08 Z-MOT1.2 Z-MOT.2
Z-3
  Bottom 1.422: U$3.OA1 57.9,72.27 57.9,76.93 57.78,77.05 Z-MOT1.3 Z-MOT.3
Z-4
  Bottom 1.422: U$3.OA2 56.28,71.36 56.28,76.26 55.24,77.29 Z-MOT1.4 Z-MOT.4

### Text on the board
tPlace: E1 | E0 | Z | Y | X | T0 | T1 | AMR3350 | T2 | Rev 1.0.5 | T3 | PWM | - | + | - | + | + | D10 | - | D11 | + | ENDSTOPS | + | 12V Z- | D12 | - | + | - | + | 5A